# EAGLE design TinyHusk (EAGLE 6.1)

## Sheet 1 of 3
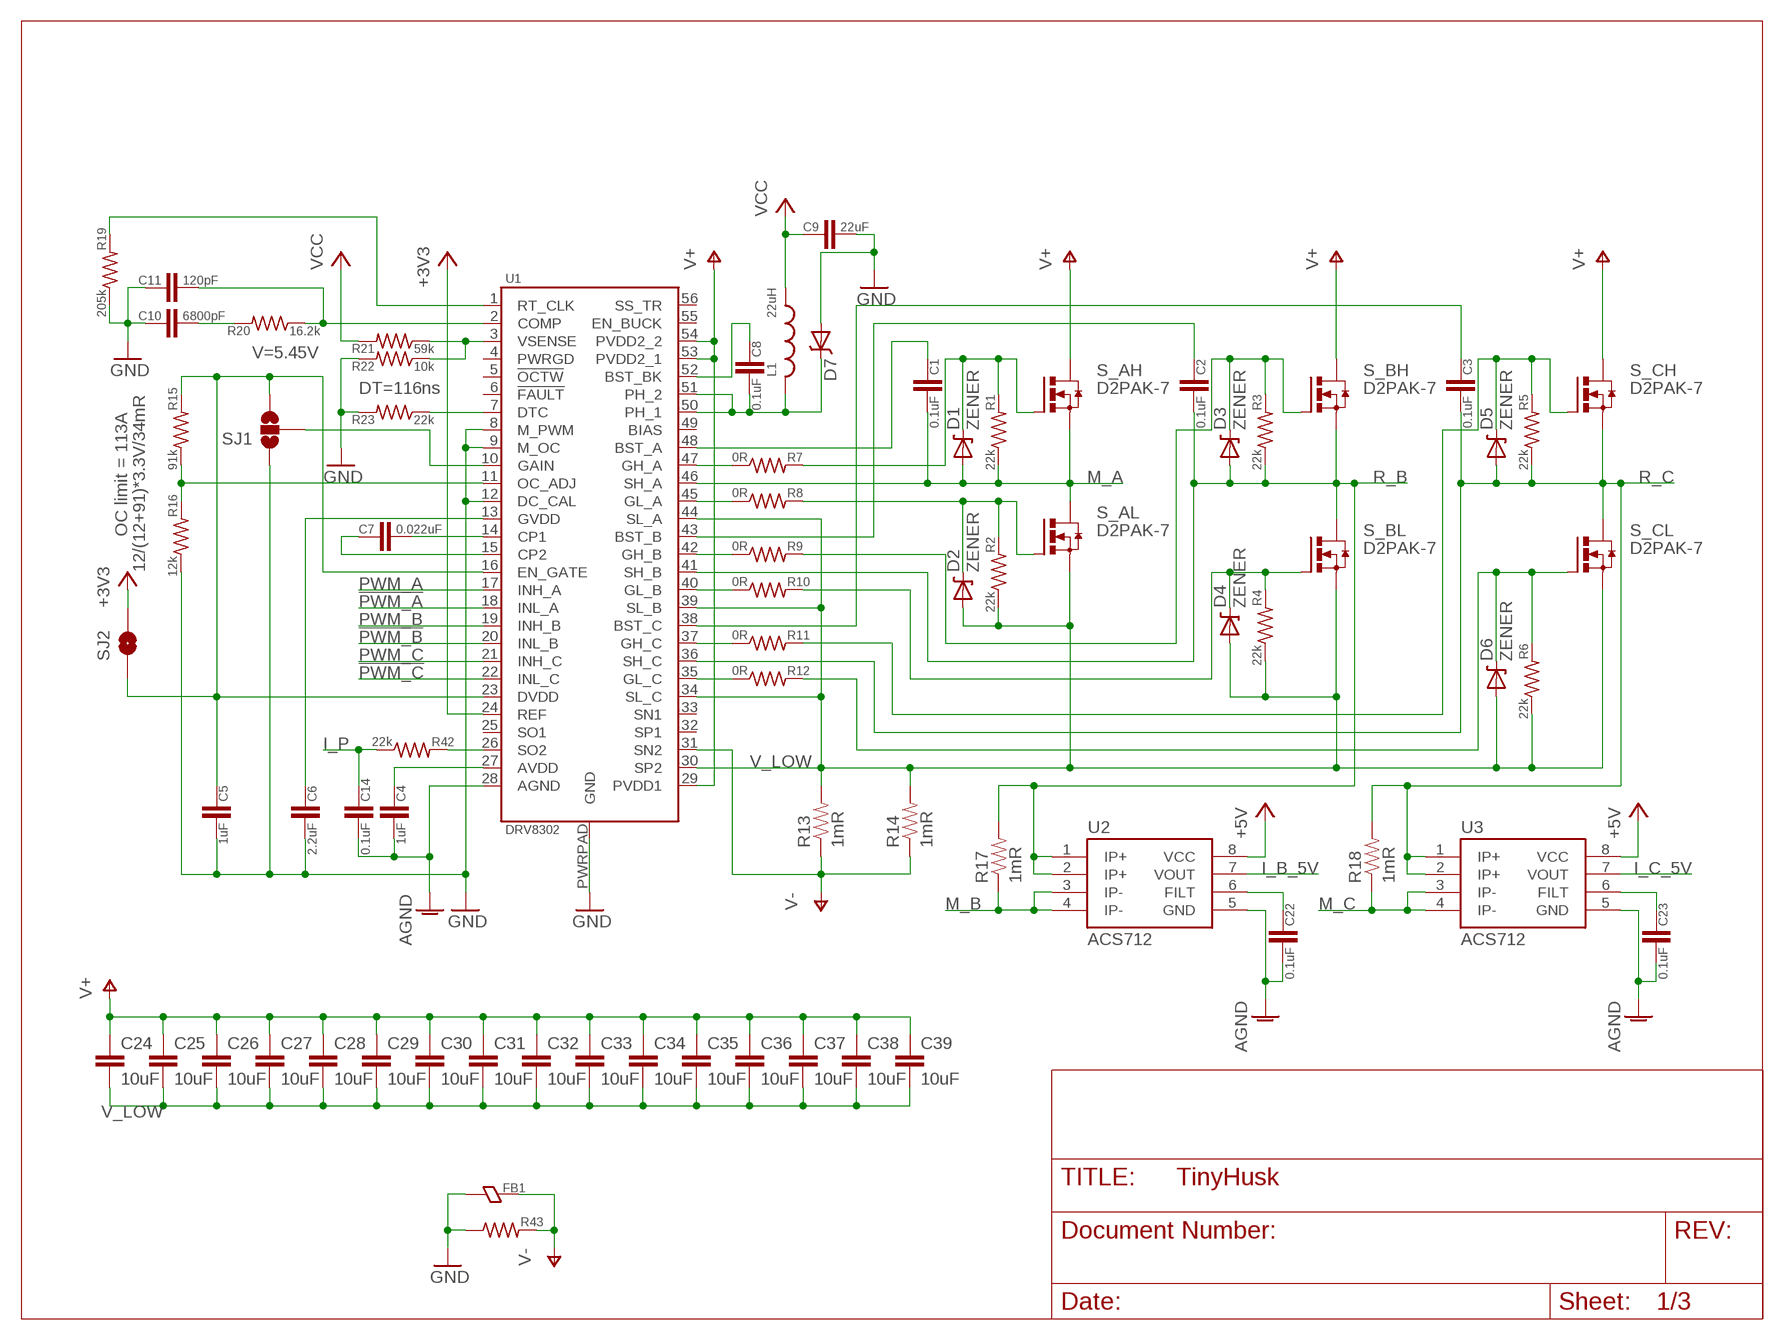
[diagram p0: schematic, sheet 1]

### Parts
C1  0.1uF  C0603  [0603]
C2  0.1uF  C0603  [0603]
C3  0.1uF  C0603  [0603]
C4  1uF  C0603  [0603]
C5  1uF  C0603  [0603]
C6  2.2uF  C0603  [0603]
C7  0.022uF  C0603  [0603]
C8  0.1uF  C0603  [0603]
C9  22uF  C0805  [0805]
C10  6800pF  C0603  [0603]
C11  120pF  C0603  [0603]
C14  0.1uF  C0603  [0603]
C22  0.1uF  C0603  [0603]
C23  0.1uF  C0603  [0603]
C24  10uF  CAP1210  [1210]
C25  10uF  CAP1210  [1210]
C26  10uF  CAP1210  [1210]
C27  10uF  CAP1210  [1210]
C28  10uF  CAP1210  [1210]
C29  10uF  CAP1210  [1210]
C30  10uF  CAP1210  [1210]
C31  10uF  CAP1210  [1210]
C32  10uF  CAP1210  [1210]
C33  10uF  CAP1210  [1210]
C34  10uF  CAP1210  [1210]
C35  10uF  CAP1210  [1210]
C36  10uF  CAP1210  [1210]
C37  10uF  CAP1210  [1210]
C38  10uF  CAP1210  [1210]
C39  10uF  CAP1210  [1210]
D1  ZENER  DIODE-ZENER-BZT52  [SOD-323]
D2  ZENER  DIODE-ZENER-BZT52  [SOD-323]
D3  ZENER  DIODE-ZENER-BZT52  [SOD-323]
D4  ZENER  DIODE-ZENER-BZT52  [SOD-323]
D5  ZENER  DIODE-ZENER-BZT52  [SOD-323]
D6  ZENER  DIODE-ZENER-BZT52  [SOD-323]
D7  DIODE-SCHOTTKY_  [SMA-DIODE]
FB1  FERRITE0603  [0603]
L1  22uH  L-US_TAIYO-YUDEN_NR50  [TAIYO-YUDEN_NR50]
R1  22k  R0603  [0603]
R2  22k  R0603  [0603]
R3  22k  R0603  [0603]
R4  22k  R0603  [0603]
R5  22k  R0603  [0603]
R6  22k  R0603  [0603]
R7  0R  R0603  [0603]
R8  0R  R0603  [0603]
R9  0R  R0603  [0603]
R10  0R  R0603  [0603]
R11  0R  R0603  [0603]
R12  0R  R0603  [0603]
R13  1mR  RESISTOR2512  [R2512]
R14  1mR  RESISTOR2512  [R2512]
R15  91k  R0603  [0603]
R16  12k  R0603  [0603]
R17  1mR  RESISTOR2512  [R2512]
R18  1mR  RESISTOR2512  [R2512]
R19  205k  R0603  [0603]
R20  16.2k  R0603  [0603]
R21  59k  R0603  [0603]
R22  10k  R0603  [0603]
R23  22k  R0603  [0603]
R42  22k  R0603  [0603]
R43  R0603  [0603]
S_AH  D2PAK-7  MOSFET-ND2PAK7  [D2PAK-7]
S_AL  D2PAK-7  MOSFET-ND2PAK7  [D2PAK-7]
S_BH  D2PAK-7  MOSFET-ND2PAK7  [D2PAK-7]
S_BL  D2PAK-7  MOSFET-ND2PAK7  [D2PAK-7]
S_CH  D2PAK-7  MOSFET-ND2PAK7  [D2PAK-7]
S_CL  D2PAK-7  MOSFET-ND2PAK7  [D2PAK-7]
SJ1  SOLDERJUMPER_2WAYS  [SJ_X]
SJ2  SOLDERJUMPERTRACE  [SJ_2S-TRACE]
U1  DRV8302  [HTSSOP-56]
U2  ACS712  [SO08]
U3  ACS712  [SO08]

### Nets
!PWM_A: U1.18(INL_A) ; also sheet 2
!PWM_B: U1.20(INL_B) ; also sheet 2
!PWM_C: U1.22(INL_C) ; also sheet 2
+3V3: SJ2.2 U1.24(REF) ; also sheet 3
+5V: U2.8(VCC) U3.8(VCC) ; also sheet 2,3
AGND: C4.2 C14.2 C22.2 C23.2 U1.28(AGND) U2.5(GND) U3.5(GND) ; also sheet 2,3
GND: C5.2 C6.2 C9.2 C10.1 C11.1 D7.A FB1.1 R16.1 R19.1 R22.2 R23.2 R43.1 SJ1.1 U1.8(M_PWM) U1.9(M_OC) U1.12(DC_CAL) U1.PWRPAD(GND) ; also sheet 2,3
I_B_5V: U2.7(VOUT) ; also sheet 2
I_C_5V: U3.7(VOUT) ; also sheet 2
I_P: C14.1 R42.1 ; also sheet 2
M_A: C1.2 D1.2(A) R1.1 S_AH.2(S) S_AH.3(S) S_AH.5(S) S_AH.6(S) S_AH.7(S) S_AL.4(D) U1.46(SH_A) ; also sheet 2
M_B: R17.1 U2.3(IP-) U2.4(IP-)
M_C: R18.1 U3.3(IP-) U3.4(IP-)
N$1: R7.1 U1.47(GH_A)
N$2: R8.1 U1.45(GL_A)
N$3: R42.2 U1.26(SO2)
N$4: D1.1(C) R1.2 R7.2 S_AH.1(G)
N$5: D3.1(C) R3.2 R9.2 S_BH.1(G)
N$6: C22.1 U2.6(FILT)
N$7: D4.1(C) R4.2 R10.2 S_BL.1(G)
N$8: R21.1 R22.1 U1.3(VSENSE)
N$9: D5.1(C) R5.2 R11.2 S_CH.1(G)
N$10: C23.1 U3.6(FILT)
N$11: D6.1(C) R6.2 R12.2 S_CL.1(G)
N$12: R9.1 U1.42(GH_B)
N$13: C1.1 U1.48(BST_A)
N$14: C2.1 U1.43(BST_B)
N$15: C3.1 U1.38(BST_C)
N$16: R10.1 U1.40(GL_B)
N$17: R11.1 U1.37(GH_C)
N$18: D2.1(C) R2.2 R8.2 S_AL.1(G)
N$19: R12.1 U1.35(GL_C)
N$20: SJ1.2 U1.10(GAIN)
N$21: C5.1 R15.2 SJ1.3 SJ2.1 U1.16(EN_GATE) U1.23(DVDD)
N$22: C4.1 U1.27(AVDD)
N$23: C6.1 U1.13(GVDD)
N$24: C7.2 U1.14(CP1)
N$25: C7.1 U1.15(CP2)
N$26: R15.1 R16.2 U1.11(OC_ADJ)
N$29: C8.2 D7.C L1.P$2 U1.50(PH_1) U1.51(PH_2)
N$30: C8.1 U1.52(BST_BK)
N$31: C11.2 R20.1 U1.2(COMP)
N$32: C10.2 R20.2
N$33: R19.2 U1.1(RT_CLK)
N$34: R23.1 U1.7(DTC)
PWM_A: U1.17(INH_A) ; also sheet 2
PWM_B: U1.19(INH_B) ; also sheet 2
PWM_C: U1.21(INH_C) ; also sheet 2
R_B: C2.2 D3.2(A) R3.1 R17.2 S_BH.2(S) S_BH.3(S) S_BH.5(S) S_BH.6(S) S_BH.7(S) S_BL.4(D) U1.41(SH_B) U2.1(IP+) U2.2(IP+) ; also sheet 2
R_C: C3.2 D5.2(A) R5.1 R18.2 S_CH.2(S) S_CH.3(S) S_CH.5(S) S_CH.6(S) S_CH.7(S) S_CL.4(D) U1.36(SH_C) U3.1(IP+) U3.2(IP+) ; also sheet 2
V+: C24.1 C25.1 C26.1 C27.1 C28.1 C29.1 C30.1 C31.1 C32.1 C33.1 C34.1 C35.1 C36.1 C37.1 C38.1 C39.1 S_AH.4(D) S_BH.4(D) S_CH.4(D) U1.29(PVDD1) U1.53(PVDD2_1) U1.54(PVDD2_2) ; also sheet 2
V-: FB1.2 R13.1 R14.1 R43.2 U1.31(SN2) ; also sheet 2
V_LOW: C24.2 C25.2 C26.2 C27.2 C28.2 C29.2 C30.2 C31.2 C32.2 C33.2 C34.2 C35.2 C36.2 C37.2 C38.2 C39.2 D2.2(A) D4.2(A) D6.2(A) R2.1 R4.1 R6.1 R13.2 R14.2 S_AL.2(S) S_AL.3(S) S_AL.5(S) S_AL.6(S) S_AL.7(S) S_BL.2(S) S_BL.3(S) S_BL.5(S) S_BL.6(S) S_BL.7(S) S_CL.2(S) S_CL.3(S) S_CL.5(S) S_CL.6(S) S_CL.7(S) U1.30(SP2) U1.34(SL_C) U1.39(SL_B) U1.44(SL_A)
VCC: C9.1 L1.P$1 R21.2 ; also sheet 3
Unconnected: U1.4(PWRGD) U1.5(!OCTW) U1.6(!FAULT) U1.25(SO1) U1.32(SP1) U1.33(SN1) U1.49(BIAS) U1.55(EN_BUCK) U1.56(SS_TR)

### Notes on the sheet
- V=5.45V
- DT=116ns
- OC limit = 113A
- 12/(12+91)*3.3V/34mR

## Sheet 2 of 3
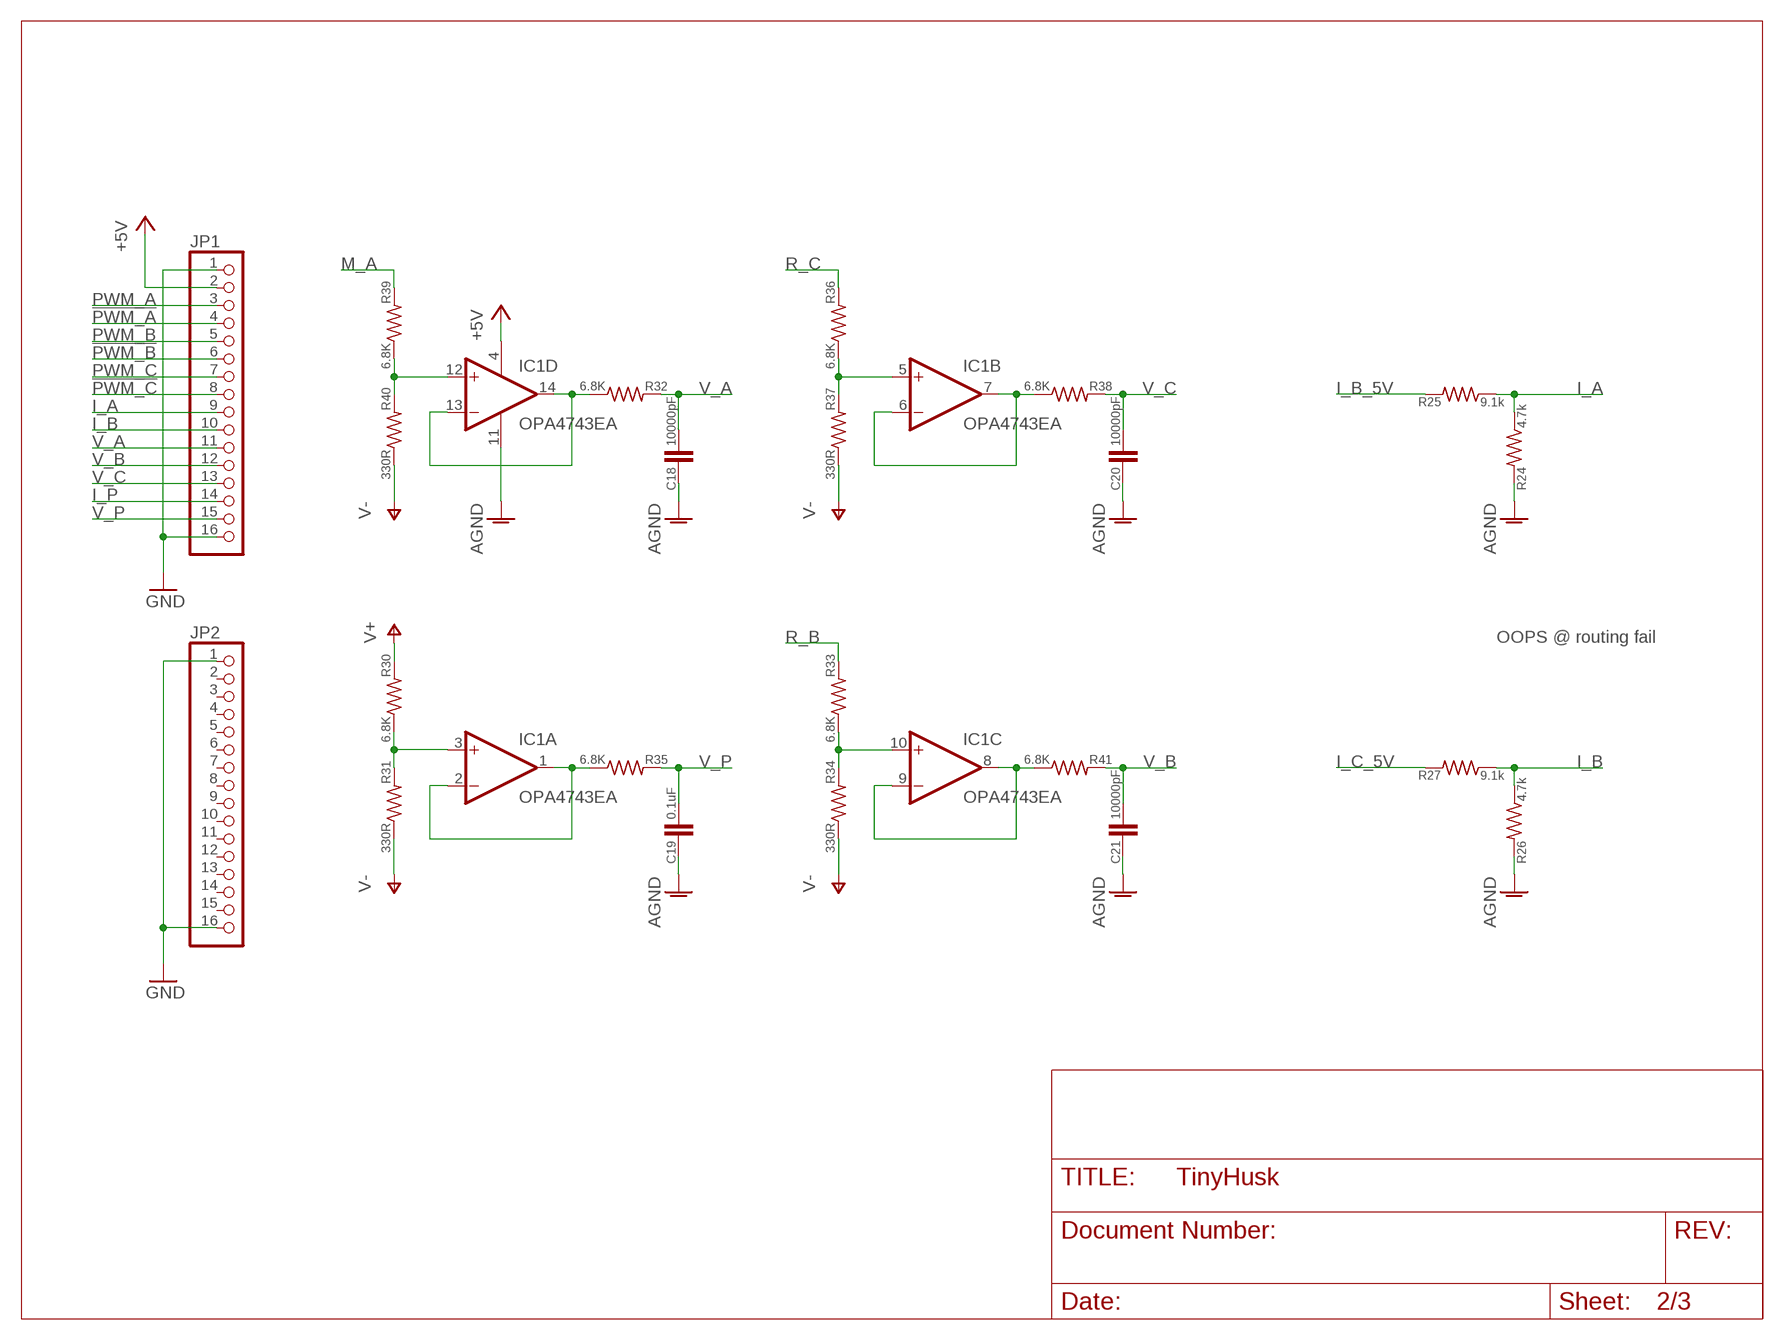
[diagram p1: schematic, sheet 2]

### Parts
C18  10000pF  C0603  [0603]
C19  0.1uF  C0603  [0603]
C20  10000pF  C0603  [0603]
C21  10000pF  C0603  [0603]
IC1  OPA4743EA  [TSSOP14]
JP1  PINHD-1X16_2.54-S  [1X16-S]
JP2  PINHD-1X16_2.54-S  [1X16-S]
R24  4.7k  R0603  [0603]
R25  9.1k  R0603  [0603]
R26  4.7k  R0603  [0603]
R27  9.1k  R0603  [0603]
R30  6.8K  R0603  [0603]
R31  330R  R0603  [0603]
R32  6.8K  R0603  [0603]
R33  6.8K  R0603  [0603]
R34  330R  R0603  [0603]
R35  6.8K  R0603  [0603]
R36  6.8K  R0603  [0603]
R37  330R  R0603  [0603]
R38  6.8K  R0603  [0603]
R39  6.8K  R0603  [0603]
R40  330R  R0603  [0603]
R41  6.8K  R0603  [0603]

### Nets
!PWM_A: JP1.4 ; also sheet 1
!PWM_B: JP1.6 ; also sheet 1
!PWM_C: JP1.8 ; also sheet 1
+5V: IC1.4(P:V+) JP1.2 ; also sheet 1,3
AGND: C18.1 C19.1 C20.1 C21.1 IC1.11(P:V-) R24.2 R26.2 ; also sheet 1,3
GND: JP1.1 JP1.16 JP2.1 JP2.16 ; also sheet 1,3
I_A: JP1.9 R24.1 R25.1
I_B: JP1.10 R26.1 R27.1
I_B_5V: R25.2 ; also sheet 1
I_C_5V: R27.2 ; also sheet 1
I_P: JP1.14 ; also sheet 1
M_A: R39.2 ; also sheet 1
N$36: IC1.1(A:OUT) IC1.2(A:-IN) R35.1
N$41: IC1.6(B:-IN) IC1.7(B:OUT) R38.1
N$42: IC1.8(C:OUT) IC1.9(C:-IN) R41.1
N$43: IC1.13(D:-IN) IC1.14(D:OUT) R32.1
N$44: IC1.3(A:+IN) R30.1 R31.2
N$46: IC1.10(C:+IN) R33.1 R34.2
N$47: IC1.5(B:+IN) R36.1 R37.2
N$48: IC1.12(D:+IN) R39.1 R40.2
PWM_A: JP1.3 ; also sheet 1
PWM_B: JP1.5 ; also sheet 1
PWM_C: JP1.7 ; also sheet 1
R_B: R33.2 ; also sheet 1
R_C: R36.2 ; also sheet 1
V+: R30.2 ; also sheet 1
V-: R31.1 R34.1 R37.1 R40.1 ; also sheet 1
V_A: C18.2 JP1.11 R32.2
V_B: C21.2 JP1.12 R41.2
V_C: C20.2 JP1.13 R38.2
V_P: C19.2 JP1.15 R35.2
Unconnected: JP2.2 JP2.3 JP2.4 JP2.5 JP2.6 JP2.7 JP2.8 JP2.9 JP2.10 JP2.11 JP2.12 JP2.13 JP2.14 JP2.15

### Notes on the sheet
- OOPS @ routing fail

## Sheet 3 of 3
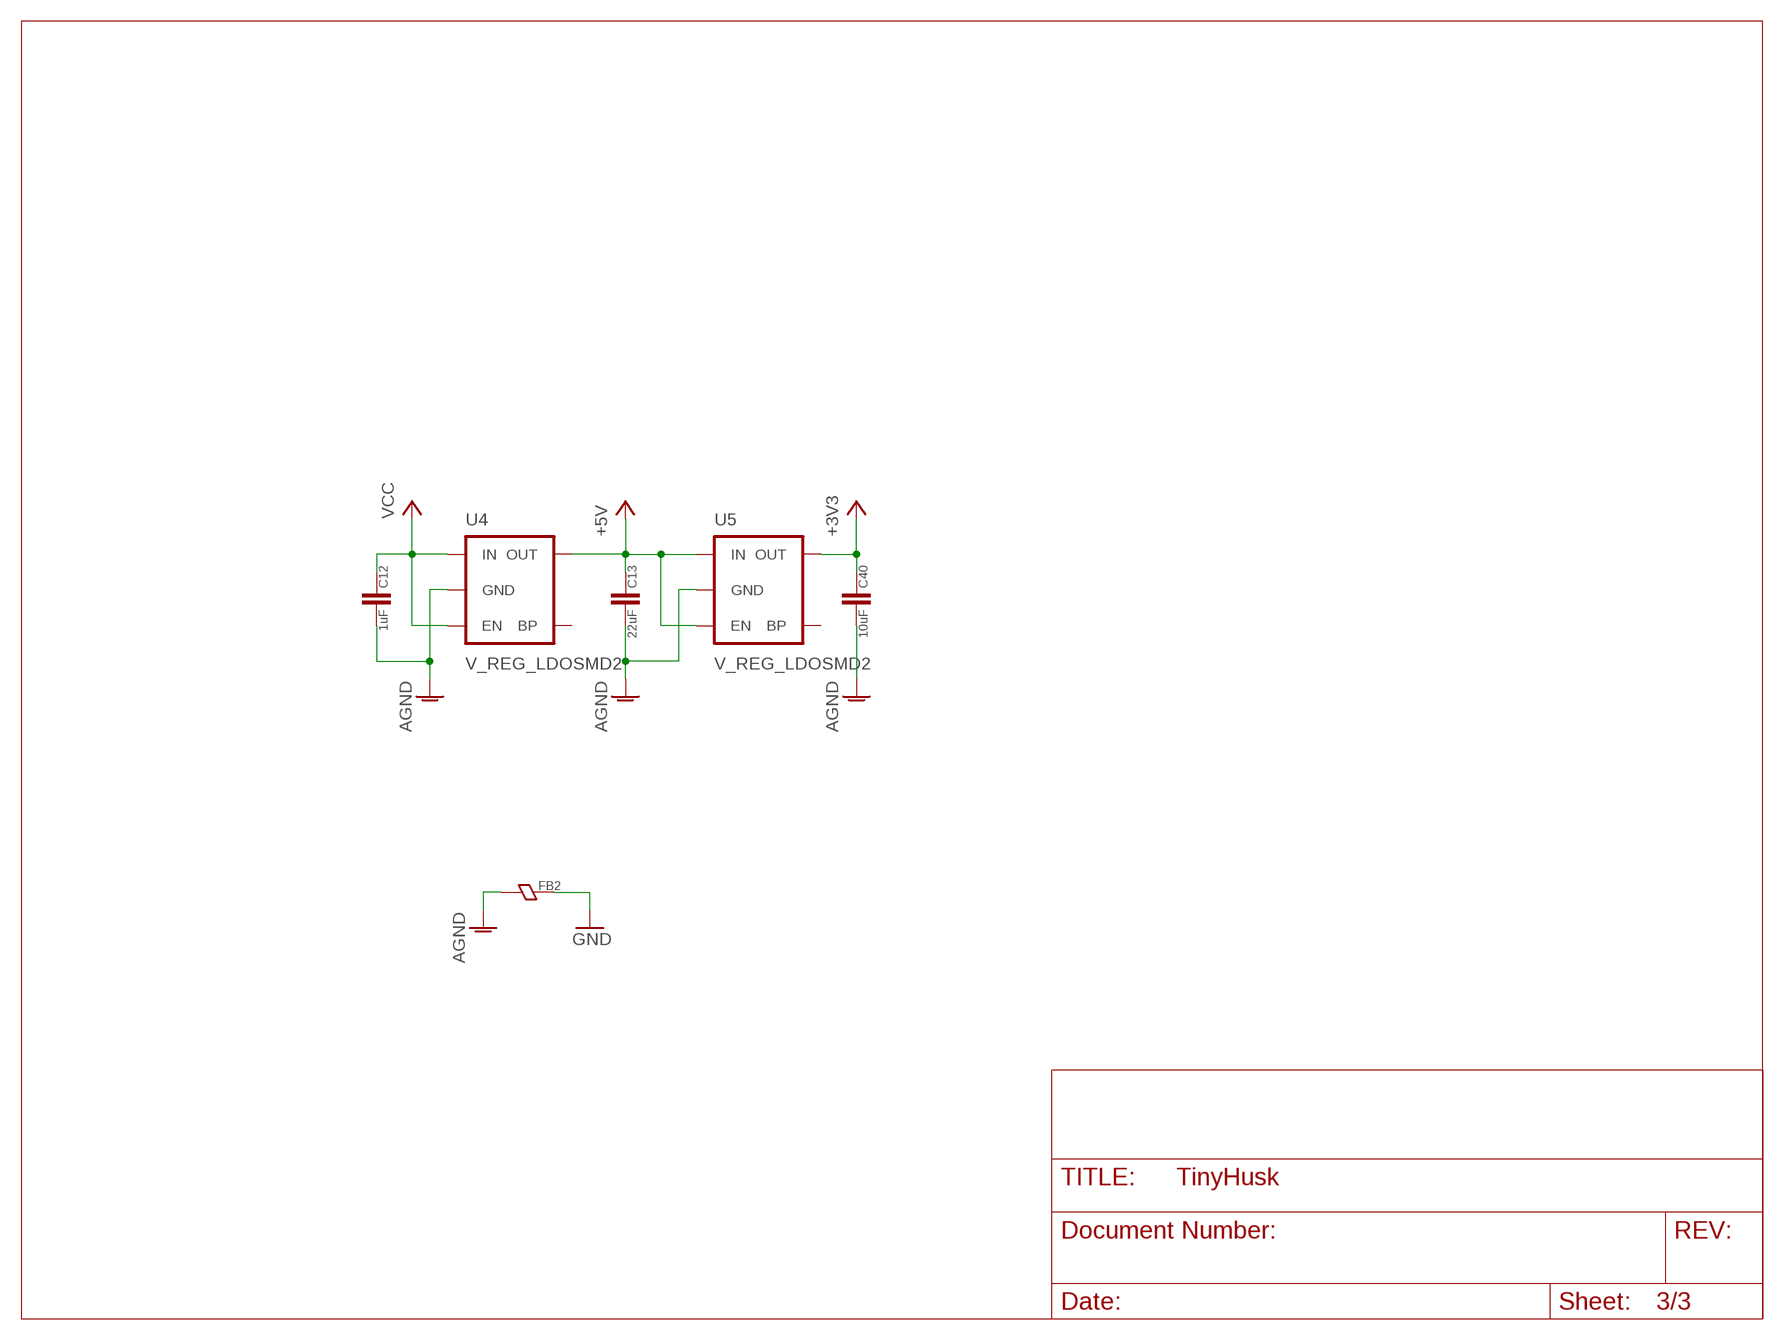
[diagram p2: schematic, sheet 3]

### Parts
C12  1uF  C0603  [0603]
C13  22uF  C0805  [0805]
C40  10uF  C0603  [0603]
FB2  FERRITE0603  [0603]
U4  V_REG_LDOSMD2  [SC70]
U5  V_REG_LDOSMD2  [SC70]

### Nets
+3V3: C40.1 U5.5(OUT) ; also sheet 1
+5V: C13.1 U4.5(OUT) U5.1(IN) U5.3(EN) ; also sheet 1,2
AGND: C12.2 C13.2 C40.2 FB2.1 U4.2(GND) U5.2(GND) ; also sheet 1,2
GND: FB2.2 ; also sheet 1,2
VCC: C12.1 U4.1(IN) U4.3(EN) ; also sheet 1
Unconnected: U4.4(BP) U5.4(BP)

## Library data of the parts
C1-C14 C18-C23 C40 = dan-rcl:C
C24-C39 = SparkFun:CAP: Capacitor Standard 0603 ceramic capacitor, and 0.1" leaded capacitor.
D1-D6 = SparkFun:DIODE-ZENER: Zener Diode Production Part - 8199 3.4V Zener Voltage
D7 = SparkFun:DIODE-SCHOTTKY
FB1 FB2 = dan-rcl:FERRITE: Ferrite Bead
IC1 = linear:OPA4743: 12V, 7MHz, CMOS, Rail-to-Rail I/O Quad OP AMP Source: http://focus.ti.com/lit/ds/sbos201/sbos201.pdf
JP1 JP2 = pinhead-2:PINHD-1X16: PIN HEADER
L1 = xow:L-US_TAIYO-YUDEN_NR
R1-R12 R15 R16 R19-R27 R30-R43 = dan-rcl:R
R13 R14 R17 R18 = SparkFun:RESISTOR: Resistor Basic schematic elements and footprints for 0603, 1206, and PTH resistors.
S_AH S_AL S_BH S_BL S_CH S_CL = xow:MOSFET-N: Power NMOSFETs in: - D2PAK-7 - 5mm x 6mm (Power56/PQFN 5x6)
SJ1 = xow:SOLDERJUMPER_2WAY: Solder Jumper 2 way solder jumper
SJ2 = SparkFun:SOLDERJUMPER: Solder Jumper Standard SMD solder jumper. Used to automate production. Two varients : Normally Open and Normally Closed are the same, but have different paste layers. NC will have a large amount of paste and should jumper during reflow.
U1 = xow:DRV8302
U2 U3 = SparkFun:ACS712
U4 U5 = SparkFun:V_REG_LDO: Voltage Regulator LDO Standard 150mA LDO voltage regulator in SOT-23 layout. Micrel part MIC5205. BP (by-pass) pin is used to lower output noise with 470pF cap.

## Board
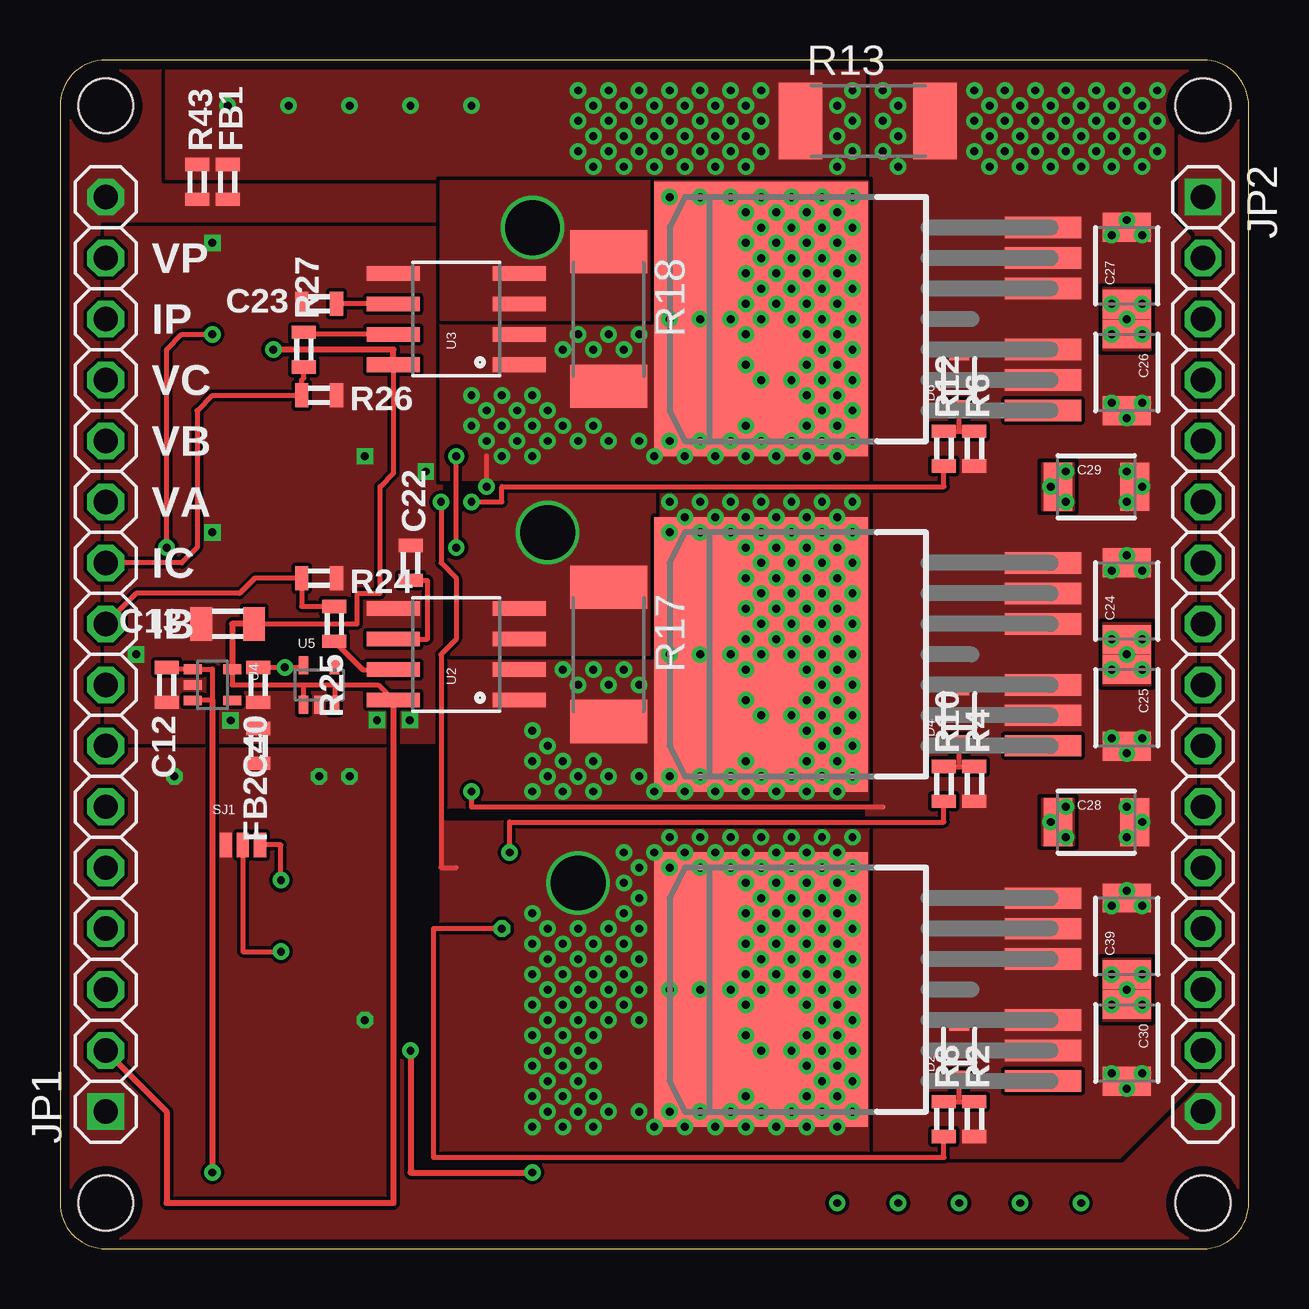
[diagram p3: board, top side]
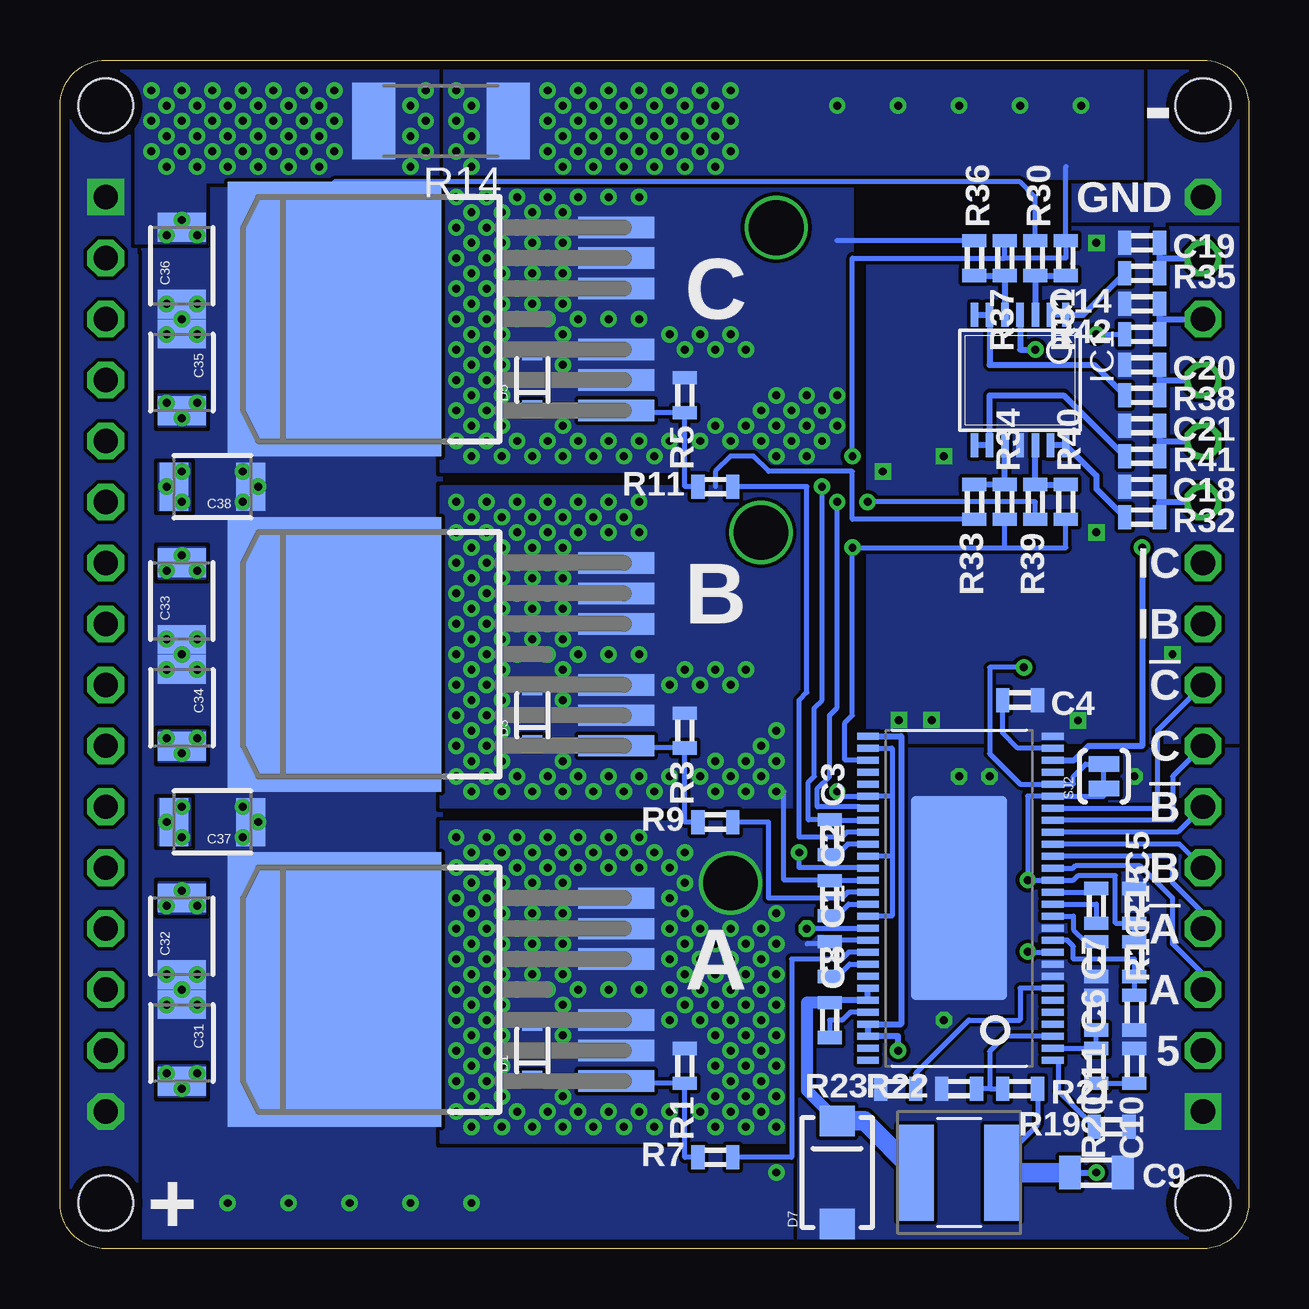
[diagram p4: board, bottom side, seen from below]

Size 49.53 x 49.53 mm. Coordinates in mm from the lower left corner, seen from the top.
Outline: 0,47.62 0,1.91 arc90 1.91,0 47.62,0 arc90 49.53,1.91 49.53,47.62 arc90 47.62,49.53 1.91,49.53 arc90 0,47.62
Copper layers (1*16): Top 0.0356mm / dielectric 1.5011mm / Bottom 0.0356mm
Design rules: minimum track width 6mil, minimum drill 13mil, track to track 6mil, track to pad 6mil, pad to pad 6mil, via to via 6mil, smd to smd 6mil, copper to edge 15mil, drill to drill 6mil, minimum pad ring 7mil, minimum via ring 7mil, stop-mask expansion 4mil, vias tented up to drill 13mil, thermal gap 10mil
Holes 2.29 mm at 1.91,47.62 47.62,47.62 47.62,1.91 1.91,1.91

### Footprints (pad centres in the part's own frame; a part is rotated, then mirrored left to right if it is on the bottom)
0603 = smd 0.55 x 1: 1 -0.725,0; 2 0.725,0
0805 = smd 0.9 x 1.4: 1 -1.1,0; 2 1.1,0
1210 = smd 1.2 x 2: 1 -1.6,0; 2 1.6,0
SOD-323 = smd 0.63 x 0.83: 1 -1.15,0; 2 1.15,0
SMA-DIODE = smd 1.27 x 1.47: A -2.15,0; C 2.15,0
TSSOP14 = smd 0.305 x 0.991: 1 -1.905,-2.718; 2 -1.27,-2.718; 3 -0.635,-2.718; 4 0,-2.718; 5 0.635,-2.718; 6 1.27,-2.718; 7 1.905,-2.718; 8 1.905,2.718; 9 1.27,2.718; 10 0.635,2.718; 11 0,2.718; 12 -0.635,2.718; 13 -1.27,2.718; 14 -1.905,2.718
1X16-S = drill 1.016 square: 1 -19.05,0 | drill 1.016 octagon: 2 -16.51,0; 3 -13.97,0; 4 -11.43,0; 5 -8.89,0; 6 -6.35,0; 7 -3.81,0; 8 -1.27,0; 9 1.27,0; 10 3.81,0; 11 6.35,0; 12 8.89,0; 13 11.43,0; 14 13.97,0; 15 16.51,0; 16 19.05,0
TAIYO-YUDEN_NR50 = smd 1.5 x 4: P$1 -1.8,0; P$2 1.8,0
R2512 = smd 1.8 x 3.2: 1 -2.8,0; 2 2.8,0
D2PAK-7 = smd 0.889 x 3.175: 1 -3.81,-7.303; 2 -2.54,-7.303; 3 -1.27,-7.303; 5 1.27,-7.303; 6 2.54,-7.303; 7 3.81,-7.303 | smd 11.43 x 8.89: 4 0,4.445
SJ_X = smd 0.508 x 1.016: 1 -0.711,0; 2 0,0; 3 0.711,0
SJ_2S-TRACE = smd 0.635 x 1.27: 1 -0.508,0; 2 0.508,0
HTSSOP-56 = smd 0.285 x 0.9: 1 -6.75,-3.9; 2 -6.25,-3.9; 3 -5.75,-3.9; 4 -5.25,-3.9; 5 -4.75,-3.9; 6 -4.25,-3.9; 7 -3.75,-3.9; 8 -3.25,-3.9; 9 -2.75,-3.9; 10 -2.25,-3.9; 11 -1.75,-3.9; 12 -1.25,-3.9; 13 -0.75,-3.9; 14 -0.25,-3.9; 15 0.25,-3.9; 16 0.75,-3.9; 17 1.25,-3.9; 18 1.75,-3.9; 19 2.25,-3.9; 20 2.75,-3.9; 21 3.25,-3.9; 22 3.75,-3.9; 23 4.25,-3.9; 24 4.75,-3.9; 25 5.25,-3.9; 26 5.75,-3.9; 27 6.25,-3.9; 28 6.75,-3.9; 29 6.75,3.8; 30 6.25,3.8; 31 5.75,3.8; 32 5.25,3.8; 33 4.75,3.8; 34 4.25,3.8; 35 3.75,3.8; 36 3.25,3.8; 37 2.75,3.8; 38 2.25,3.8; 39 1.75,3.8; 40 1.25,3.8; 41 0.75,3.8; 42 0.25,3.8; 43 -0.25,3.8; 44 -0.75,3.8; 45 -1.25,3.8; 46 -1.75,3.8; 47 -2.25,3.8; 48 -2.75,3.8; 49 -3.25,3.8; 50 -3.75,3.8; 51 -4.25,3.8; 52 -4.75,3.8; 53 -5.25,3.8; 54 -5.75,3.8; 55 -6.25,3.8; 56 -6.75,3.8 | smd 8.5 x 4: PWRPAD 0,0
SO08 = smd 0.61 x 2.21: 1 -1.905,-2.616; 2 -0.635,-2.616; 3 0.635,-2.616; 4 1.905,-2.616; 5 1.905,2.616; 6 0.635,2.616; 7 -0.635,2.616; 8 -1.905,2.616
SC70 = smd 0.4 x 0.75: 1 -0.65,-0.825; 2 0,-0.825; 3 0.65,-0.825; 4 0.65,0.825; 5 -0.65,0.825

### Placement (x,y rotation side)
C1  17.46,12.06 90 bottom
C2  17.46,14.61 90 bottom
C3  17.46,17.15 90 bottom
C4  9.53,22.86 0 bottom
C5  4.76,14.29 90 bottom
C6  6.35,12.06 270 bottom
C7  6.35,14.29 270 bottom
C8  17.46,9.53 90 bottom
C9  6.35,3.17 0 bottom
C10  4.76,7.62 270 bottom
C11  6.35,9.84 270 bottom
C12  4.45,23.5 270 top
C13  6.98,26.04 180 top
C14  4.45,39.37 180 bottom
C18  4.45,31.75 0 bottom
C19  4.45,41.91 0 bottom
C20  4.45,36.83 0 bottom
C21  4.45,34.29 0 bottom
C22  14.61,28.58 90 top
C23  10.79,39.37 180 top
C24  44.45,26.99 90 top
C25  44.45,22.54 270 top
C26  44.45,36.51 270 top
C27  44.45,40.96 90 top
C28  43.18,17.78 0 top
C29  43.18,31.75 0 top
C30  44.45,8.57 270 top
C31  44.45,8.57 270 bottom
C32  44.45,13.02 90 bottom
C33  44.45,26.99 90 bottom
C34  44.45,22.54 270 bottom
C35  44.45,36.51 270 bottom
C36  44.45,40.96 90 bottom
C37  43.18,17.78 180 bottom
C38  43.18,31.75 180 bottom
C39  44.45,13.02 90 top
C40  8.26,23.5 270 top
D1  29.85,8.26 90 bottom
D2  37.46,8.26 90 top
D3  29.85,22.23 90 bottom
D4  37.46,22.23 90 top
D5  29.85,36.2 90 bottom
D6  37.46,36.2 90 top
D7  17.15,3.17 90 bottom
FB1  6.98,44.45 90 top
FB2  8.26,20.96 270 top
IC1  9.53,36.2 180 bottom
JP1  1.91,24.77 90 top
JP2  47.62,24.77 270 top
L1  12.06,3.17 180 bottom
R1  23.5,7.62 270 bottom
R2  38.1,5.4 90 top
R3  23.5,21.59 270 bottom
R4  38.1,19.37 90 top
R5  23.5,35.56 270 bottom
R6  38.1,33.34 90 top
R7  22.23,3.81 180 bottom
R8  36.83,5.4 90 top
R9  22.23,17.78 180 bottom
R10  36.83,19.37 90 top
R11  22.23,31.75 180 bottom
R12  36.83,33.34 90 top
R13  33.66,46.99 0 top
R14  33.66,46.99 180 bottom
R15  4.76,12.06 90 bottom
R16  4.76,9.84 90 bottom
R17  22.86,24.77 270 top
R18  22.86,38.73 270 top
R19  5.71,5.08 180 bottom
R20  6.35,7.62 270 bottom
R21  9.53,6.67 0 bottom
R22  12.06,6.67 180 bottom
R23  14.61,6.67 180 bottom
R24  10.79,27.94 0 top
R25  11.43,26.04 270 top
R26  10.79,35.56 0 top
R27  10.16,37.46 90 top
R30  8.89,41.27 90 bottom
R31  7.62,41.27 270 bottom
R32  4.45,30.48 0 bottom
R33  11.43,31.12 270 bottom
R34  10.16,31.12 90 bottom
R35  4.45,40.64 0 bottom
R36  11.43,41.27 90 bottom
R37  10.16,41.27 270 bottom
R38  4.45,35.56 0 bottom
R39  8.89,31.12 270 bottom
R40  7.62,31.12 90 bottom
R41  4.45,33.02 0 bottom
R42  4.45,38.1 180 bottom
R43  5.71,44.45 90 top
S_AH  33.66,10.79 90 bottom
S_AL  33.66,10.79 90 top
S_BH  33.66,24.77 90 bottom
S_BL  33.66,24.77 90 top
S_CH  33.66,38.73 90 bottom
S_CL  33.66,38.73 90 top
SJ1  7.62,16.83 0 top
SJ2  6.03,19.69 90 bottom
U1  12.06,14.61 90 bottom
U2  16.51,24.77 90 top
U3  16.51,38.73 90 top
U4  6.35,23.5 270 top
U5  10.79,23.5 0 top

### Tracks (layer width: path | path; a pad name or v marks a point on that pad's centre or on a via)
!PWM_A
  Bottom 0.203: JP1.4 1.91,13.97 3.17,15.24 3.17,16.36 U1.18 7.3,16.36
!PWM_B
  Bottom 0.203: JP1.6 2.96,17.36 U1.20
!PWM_C
  Bottom 0.203: JP1.8 3.81,21.59 3.81,18.36 U1.22
+3V3  (via drill 0.33)
  Top 0.203: C40.1 v9.37,24.22 10.14,24.22 U5.5
  Bottom 0.203: v9.37,24.22 10.79,24.22 10.79,20.62 9.53,19.36 U1.24 7.3,19.36 7.3,19.69 6.79,20.19 SJ2.2
+5V  (via drill 0.33)
  Top 0.203: U4.5 7.17,23.5 10.14,23.5 | U2.8 13.26,23.5 11.45,23.5 | C13.1 12.38,26.04 12.38,27.31 13.33,27.31 13.33,31.75 13.89,32.31 U3.8 | 10.14,23.5 U5.1 | 10.14,23.5 11.45,23.5 | 11.45,23.5 U5.3
  Top 0.254: JP1.2 4.45,5.71 4.45,1.91 13.89,1.91 U2.8 | U3.8 13.89,37.46 v8.89,37.46 | C13.1 7.17,26.04 U4.5
  Bottom 0.254: IC1.4 9.53,37.46 v8.89,37.46
AGND  (via drill 0.33)
  other vias: 3.17,24.77 15.24,32.38 12.7,33.02 6.35,29.85 6.35,41.91 7.11,22.01 14.58,22.02 13.21,22.02
  pour Bottom (rank 5, no thermals): 0,42.54 15.88,42.54 15.88,21.11 0,21.11
  pour Top (rank 5, no thermals): 1.91,42.54 1.91,21.11 15.88,21.11 15.88,42.54
GND  (via drill 0.33)
  other vias: 12.7,9.53 12.06,19.69 10.79,19.69 4.76,19.69
  pour Bottom (rank 6, no thermals): 47.62,0 1.91,0 arc-90 0,1.91 0,47.62 arc-90 1.91,49.53 47.62,49.53 arc-90 49.53,47.62 49.53,1.91 arc-90
  pour Top (rank 6, no thermals): 47.62,0 1.91,0 arc-90 0,1.91 0,47.62 arc-90 1.91,49.53 47.62,49.53 arc-90 49.53,47.62 49.53,1.91 arc-90
I_A
  Top 0.203: JP1.9 3.17,27.31 7.49,27.31 8.12,27.94 R24.1 10.07,26.76 R25.1
I_B
  Top 0.203: JP1.10 5.08,28.58 5.71,29.21 5.71,34.92 6.35,35.56 R26.1 10.07,36.2 10.16,36.28 R27.1
I_B_5V
  Top 0.203: R25.2 12.61,24.13 U2.7
I_C_5V
  Top 0.203: U3.7 10.16,38.1 R27.2
I_P
  Bottom 0.254: C14.1 3.72,38.73 | 3.72,38.73 JP1.14 | 3.72,38.73 R42.1
M_A  (via drill 0.33, 2.29)
  Top 0.203: v15.88,31.12 15.88,28.58 16.51,27.94 16.51,25.4 15.88,24.77 15.88,15.88 16.51,15.88
  Bottom 0.203: U1.46 17.08,12.86 C1.2 17.15,12.7 18.42,12.7 | R39.2 8.89,31.12 v15.88,31.12
  other vias: 33.02,17.15 32.38,16.51 33.02,15.88 32.38,15.24 33.02,14.61 32.38,13.97 33.02,13.33 32.38,12.7 33.02,12.06 32.38,11.43 33.02,10.79 32.38,10.16 33.02,9.53 32.38,8.89 33.02,8.26 32.38,7.62 33.02,6.98 32.38,6.35 33.02,5.71 31.75,17.15 31.12,16.51 31.75,15.88 31.12,15.24 31.75,14.61 31.12,13.97 31.75,13.33 31.12,12.7 31.75,12.06 31.12,11.43 31.75,10.79 31.12,10.16 31.75,9.53 31.12,8.89 31.75,8.26 31.12,7.62 31.75,6.98 31.12,6.35 31.75,5.71 21.59,13.33 20.96,12.7 21.59,12.06 20.96,11.43 21.59,10.79 20.96,10.16 21.59,9.53 20.96,8.89 21.59,8.26 20.96,7.62 21.59,6.98 20.96,6.35 21.59,5.71 19.69,13.97 20.32,13.33 19.69,12.7 20.32,12.06 19.69,11.43 20.32,10.79 19.69,10.16 20.32,9.53 19.69,8.89 20.32,8.26 19.69,7.62 20.32,6.98 19.69,6.35 20.32,5.71 22.86,13.33 22.23,12.7 22.86,12.06 22.23,11.43 22.86,10.79 22.23,10.16 22.86,9.53 22.23,8.89 22.23,7.62 22.23,6.35 22.86,5.71 23.5,16.51 24.13,15.88 23.5,15.24 24.13,14.61 23.5,13.97 24.13,13.33 23.5,12.7 24.13,12.06 23.5,11.43 24.13,10.79 23.5,10.16 24.13,9.53 30.48,17.15 29.85,16.51 30.48,15.88 29.85,15.24 30.48,14.61 29.85,13.97 30.48,13.33 29.85,12.7 30.48,12.06 29.85,11.43 30.48,10.79 29.21,17.15 28.58,16.51 29.21,15.88 28.58,15.24 29.21,14.61 28.58,13.97 29.21,13.33 28.58,12.7 29.21,12.06 28.58,11.43 29.21,10.79 28.58,10.16 28.58,8.89 30.48,8.26 29.21,8.26 30.48,5.71 29.21,5.71 28.58,6.35 27.94,5.71 26.67,5.71 25.4,5.71 24.13,5.71 27.94,10.79 26.67,10.79 25.4,10.79 27.94,17.15 27.31,16.51 26.67,17.15 26.04,16.51 25.4,17.15 24.77,16.51 25.4,15.88 26.67,15.88 27.94,15.88 19.69,5.08 20.96,5.08 22.23,5.08 24.77,5.08 26.04,5.08 27.31,5.08 28.58,5.08 29.85,5.08 31.12,5.08 32.38,5.08 21.59,15.24
  pour Bottom (rank 2, no thermals): 33.66,17.78 20,17.78 20,14.61 17.78,14.61 17.78,12.06 19.05,12.06 19.05,4.45 33.66,4.45
  pour Top (rank 2, no thermals): 15.88,17.78 33.66,17.78 33.66,3.81 15.88,3.81
M_B  (via drill 2.29)
  other vias: 20.32,29.85
  pour Top (no thermals): 24.77,31.75 15.88,31.75 15.88,24.77 24.77,24.77
M_C  (via drill 2.29)
  other vias: 19.69,42.54
  pour Top (no thermals): 24.77,38.73 15.88,38.73 15.88,44.45 24.77,44.45
N$1
  Bottom 0.203: U1.47 16.66,12.36 16.96,12.06 19.05,12.06 19.05,3.81 R7.1
N$2  (via drill 0.33)
  Top 0.203: v18.42,13.33 15.56,13.33 15.56,3.81 36.83,3.81 R8.1
  Bottom 0.203: U1.45 16.19,13.33 v18.42,13.33
N$3  (via drill 0.33)
  Top 0.203: v4.45,29.21 4.45,37.46 5.08,38.1 v6.35,38.1
  Bottom 0.203: v6.35,38.1 R42.2
  Bottom 0.254: U1.26 7.27,20.36 6.67,20.96 4.45,20.96 v4.45,29.21
N$4
  Bottom 0.203: R7.2 23.5,3.81 R1.2 26.35,6.89 S_AH.1 26.35,7.1 D1.1
N$5
  Bottom 0.203: R9.2 23.5,17.78 R3.2 | R3.2 23.5,20.96 | R3.2 26.35,20.87 S_BH.1 26.35,21.08 D3.1
N$6
  Top 0.203: C22.1 15.3,27.85 15.3,25.4 U2.6
N$7
  Top 0.203: S_BL.1 40.96,21.08 D4.1 37.46,20.09 | R10.2 37.46,20.09 | 37.46,20.09 R4.2
N$8
  Bottom 0.203: U1.3 10.16,8.86 10.79,8.22 10.79,6.67 | 10.79,6.67 R21.1 | 10.79,6.67 R22.1
N$9
  Bottom 0.203: R11.2 23.5,31.75 R5.2 26.35,34.84 S_CH.1 26.35,35.04 D5.1
N$10
  Top 0.203: U3.6 C23.1
N$11
  Top 0.203: S_CL.1 40.96,35.04 D6.1 37.46,34.06 | R12.2 37.46,34.06 | 37.46,34.06 R6.2
N$12
  Bottom 0.203: U1.42 16.71,14.86 16.96,14.61 20,14.61 20,17.78 R9.1
N$13
  Bottom 0.203: U1.48 16.63,11.86 17.15,11.34 C1.1
N$14
  Bottom 0.203: U1.43 16.67,14.36 17.15,13.88 C2.1
N$15
  Bottom 0.203: U1.38 16.71,16.86 17.15,16.42 C3.1
N$16  (via drill 0.33)
  Top 0.203: R10.1 36.83,17.78 18.73,17.78 v18.73,16.51
  Bottom 0.203: v18.73,16.51 18.73,15.88 16.19,15.88 U1.40
N$17
  Bottom 0.203: U1.37 16.75,17.36 16.96,17.15 18.73,17.15 18.73,22.86 18.42,23.18 18.42,31.75 R11.1
N$18
  Top 0.203: S_AL.1 40.96,7.1 D2.1 37.46,6.12 | R8.2 37.46,6.12 | 37.46,6.12 R2.2
N$19  (via drill 0.33)
  Top 0.203: v17.15,31.12 18.42,31.12 18.42,31.75 36.83,31.75 R12.1
  Bottom 0.203: v17.15,31.12 17.15,22.54 17.46,22.23 17.46,19.69 17.97,19.18 17.97,18.42 16.23,18.42 U1.35
N$20  (via drill 0.33)
  Top 0.203: SJ1.2 7.62,12.38 v9.21,12.38
  Bottom 0.203: v9.21,12.38 9.21,12.36 U1.10
N$21  (via drill 0.33)
  Top 0.203: v9.21,15.36 9.21,16.83 SJ1.3
  Bottom 0.203: R15.2 C5.1 5.56,13.56 5.56,15.56 7.1,15.56 7.3,15.36 U1.16 v9.21,15.36 9.21,18.86 U1.23 6.03,18.86 SJ2.1
N$22
  Bottom 0.203: U1.27 9.62,20.86 10.25,21.49 C4.1
N$23
  Bottom 0.203: 8.19,13.86 U1.13 7.3,13.86 7.3,13.3 6.79,12.79 C6.1
N$24
  Bottom 0.203: 8.01,14.36 U1.14 6.35,14.36 C7.2
N$25
  Bottom 0.203: U1.15 6.35,14.86 C7.1
N$26
  Bottom 0.203: R16.2 R15.1 4.76,12.06 7.3,12.06 7.3,12.6 7.56,12.86 U1.11
N$29
  Bottom 0.203: 17.04,10.36 C8.2
  Bottom 0.254: 17.04,10.36 U1.51 U1.50
  Bottom 0.508: C8.2 18.42,10.25 18.42,6.59 D7.C
  Bottom 0.813: D7.C 16.02,5.33 L1.P$2
N$30
  Bottom 0.203: U1.52 16.6,9.86 16.93,9.53 17.46,9.53 C8.1
N$31
  Bottom 0.203: C11.2 R20.1 U1.2
N$32
  Bottom 0.203: R20.2 C10.2
N$33
  Bottom 0.203: U1.1 7.94,7.85 7.94,6.58 R19.2
N$34
  Bottom 0.203: U1.7 9.53,10.86 9.53,9.53 11.66,9.53 13.88,7.3 R23.1
N$36
  Bottom 0.254: IC1.2 IC1.1 6.9,38.91 R35.1
N$41
  Bottom 0.254: IC1.7 IC1.6 10.79,36.83 6.44,36.83 R38.1
N$42
  Bottom 0.254: IC1.8 IC1.9 10.79,35.56 7.71,35.56 R41.1
N$43
  Bottom 0.254: IC1.13 IC1.14 6.35,32.21 6.35,31.66 R32.1
N$44
  Bottom 0.254: R31.2 R30.1 IC1.3
N$46
  Bottom 0.254: R33.1 R34.2 IC1.10
N$47
  Bottom 0.254: R36.1 R37.2 IC1.5
N$48
  Bottom 0.254: IC1.12 R39.1 R40.2
PWM_A
  Bottom 0.203: JP1.3 1.91,11.43 3.17,12.7 3.17,14.61 4.55,15.98 7.2,15.98 7.32,15.86 U1.17
PWM_B
  Bottom 0.203: JP1.5 2.88,16.86 U1.19
PWM_C
  Bottom 0.203: JP1.7 3.17,19.69 3.17,17.86 U1.21
R_B  (via drill 0.33)
  Bottom 0.203: C2.2 17.15,15.36 | 17.15,15.36 U1.41 | 17.15,15.36 19.37,15.36 19.37,19.05 | R33.2 16.51,30.39 16.51,32.38 20,32.38 20.64,33.02 21.59,33.02 22.23,32.38 22.23,31.75
  other vias: 33.02,31.12 32.38,30.48 33.02,29.85 32.38,29.21 33.02,28.58 32.38,27.94 33.02,27.31 32.38,26.67 33.02,26.04 32.38,25.4 33.02,24.77 32.38,24.13 33.02,23.5 32.38,22.86 33.02,22.23 32.38,21.59 33.02,20.96 32.38,20.32 33.02,19.69 32.38,19.05 31.75,31.12 31.12,30.48 31.75,29.85 31.12,29.21 31.75,28.58 31.12,27.94 31.75,27.31 31.12,26.67 31.75,26.04 31.12,25.4 31.75,24.77 31.12,24.13 31.75,23.5 31.12,22.86 31.75,22.23 31.12,21.59 31.75,20.96 31.12,20.32 31.75,19.69 31.12,19.05 30.48,19.69 29.85,19.05 28.58,20.32 29.21,19.69 28.58,19.05 30.48,31.12 29.85,30.48 30.48,29.85 29.85,29.21 30.48,28.58 29.85,27.94 30.48,27.31 29.85,26.67 30.48,26.04 29.85,25.4 30.48,24.77 29.21,31.12 28.58,30.48 29.21,29.85 28.58,29.21 29.21,28.58 28.58,27.94 29.21,27.31 28.58,26.67 29.21,26.04 28.58,25.4 29.21,24.77 28.58,24.13 30.48,22.23 29.21,22.23 28.58,22.86 27.94,31.12 27.31,30.48 26.67,31.12 26.04,30.48 25.4,31.12 25.4,29.85 26.67,29.85 27.94,29.85 27.94,24.77 26.67,24.77 25.4,24.77 27.94,19.69 27.31,19.05 26.67,19.69 26.04,19.05 25.4,19.69 24.77,19.05 24.13,19.69 22.86,19.69 22.23,19.05 22.23,20.32 21.59,19.69 20.96,20.32 20.96,19.05 20.32,19.69 19.69,19.05 19.69,20.32 19.69,21.59 23.5,24.13 24.13,23.5 22.86,23.5 22.23,24.13 21.59,23.5 20.96,24.13 20.32,20.96
  pour Bottom (rank 2, no thermals): 33.66,31.75 18.42,31.75 18.42,18.42 33.66,18.42
  pour Top (rank 2, no thermals): 24.77,31.75 33.66,31.75 33.66,18.42 15.88,18.42 15.88,24.77 24.77,24.77
R_C  (via drill 0.33)
  Top 0.203: v17.78,31.75 17.78,33.02
  Bottom 0.203: U1.36 17.13,17.86 C3.2 18.35,17.87 18.35,19.43 18.1,19.69 18.1,22.54 17.78,22.86 v17.78,31.75 | R36.2 17.15,42
  other vias: 33.02,43.81 32.38,43.18 33.02,42.54 32.38,41.91 33.02,41.27 32.38,40.64 33.02,40 32.38,39.37 33.02,38.73 32.38,38.1 33.02,37.46 32.38,36.83 33.02,36.2 32.38,35.56 33.02,34.92 32.38,34.29 33.02,33.66 32.38,33.02 31.12,33.02 31.75,43.81 31.12,43.18 31.75,42.54 31.12,41.91 31.75,41.27 31.12,40.64 31.75,40 31.12,39.37 31.75,38.73 31.12,38.1 31.75,37.46 31.12,36.83 31.75,36.2 31.12,35.56 31.75,34.92 31.12,34.29 31.75,33.66 30.48,43.81 29.85,43.18 30.48,42.54 29.85,41.91 30.48,41.27 29.85,40.64 30.48,40 29.85,39.37 30.48,38.73 30.48,36.2 30.48,33.66 29.85,33.02 28.58,33.02 29.21,43.81 28.58,43.18 29.21,42.54 28.58,41.91 29.21,41.27 28.58,40.64 29.21,40 28.58,39.37 29.21,38.73 28.58,38.1 28.58,36.83 29.21,36.2 28.58,34.29 29.21,33.66 27.94,43.81 26.67,43.81 25.4,43.81 27.94,38.73 26.67,38.73 25.4,38.73 27.94,33.66 27.31,33.02 26.67,33.66 26.04,33.02 25.4,33.66 24.77,33.02 24.13,33.66 22.86,33.66 22.23,34.29 21.59,33.66 20.96,34.29 20.32,33.66 19.69,34.29 19.05,33.66 18.42,34.29 17.78,33.66 17.78,34.92 19.05,34.92 19.69,35.56 18.42,35.56 24.13,38.1 23.5,37.46 22.86,38.1 22.23,37.46 21.59,38.1 20.96,37.46 19.69,33.02 17.15,35.56 17.15,34.29 20.32,34.92 18.42,33.02
  pour Bottom (rank 2, no thermals): 33.66,44.45 16.51,44.45 16.51,32.38 33.66,32.38
  pour Top (rank 2, no thermals): 24.77,44.45 33.66,44.45 33.66,32.07 15.88,32.07 15.88,38.73 24.77,38.73
V+  (via drill 0.33)
  Top 0.254: v14.61,8.26 14.61,3.17 v19.69,3.17
  Bottom 0.203: R30.2 8.89,43.81 9.53,44.45 38.1,44.45 S_CH.4
  Bottom 0.254: U1.29 14.48,21.36 14.48,9.36 U1.53 U1.54 14.61,8.86 v14.61,8.26
  other vias: 43.81,24.13 43.81,25.4 45.09,25.4 45.09,39.37 44.45,38.73 43.81,38.1 43.81,10.16 45.09,38.1 45.09,24.13 41.91,32.38 41.91,31.12 41.27,17.78 41.91,18.42 41.91,17.15 44.45,10.79 43.81,11.43 45.09,10.16 45.09,11.43 44.45,24.77 43.81,39.37 41.27,31.75 42.54,1.91 40,1.91 37.46,1.91 34.92,1.91 32.38,1.91
  pour Bottom (rank 5, no thermals): 33.66,44.45 46.35,44.45 46.35,41.91 46.04,41.59 46.04,0 19.05,0 19.05,4.45 33.66,4.45
  pour Top (rank 4, no thermals): 45.4,26.04 45.4,23.5 43.5,23.5 43.5,26.04
  pour Top (rank 4, no thermals): 43.5,37.46 43.5,40 45.4,40 45.4,37.46
  pour Top (rank 4, no thermals): 40.96,16.83 42.23,16.83 42.23,18.73 40.96,18.73
  pour Top (rank 4, no thermals): 43.5,9.53 43.5,12.06 45.4,12.06 45.4,9.53
  pour Top (rank 4, no thermals): 42.23,30.8 40.96,30.8 40.96,32.7 42.23,32.7
V-  (via drill 0.33)
  Top 0.203: v16.51,29.21 v16.51,33.02
  Bottom 0.203: U1.31 16.83,20.36 16.83,21.91 16.51,22.23 v16.51,29.21 10.16,29.21 | 10.16,29.21 R34.1 | 10.16,29.21 7.62,29.21 R40.1 | 10.16,41.27 7.62,41.27 R31.1 7.62,45.09 | 10.16,41.27 R37.1 | v16.51,33.02 16.51,41.27 10.16,41.27
  other vias: 33.02,48.26 32.38,47.62 33.02,46.99 32.38,46.35 33.02,45.72 32.38,45.09 29.21,45.72 28.58,45.09 29.21,46.99 28.58,46.35 28.58,47.62 29.21,48.26 22.23,45.09 21.59,45.72 22.23,46.35 21.59,46.99 22.23,47.62 21.59,48.26 23.5,45.09 22.86,45.72 23.5,46.35 22.86,46.99 23.5,47.62 22.86,48.26 24.77,45.09 24.13,45.72 24.77,46.35 24.13,46.99 24.77,47.62 24.13,48.26 26.04,45.09 25.4,45.72 26.04,46.35 25.4,46.99 26.04,47.62 25.4,48.26 27.31,45.09 26.67,45.72 27.31,46.35 26.67,46.99 27.31,47.62 26.67,48.26 27.94,45.72 27.94,46.99 27.94,48.26 17.15,47.62 14.61,47.62 12.06,47.62 9.53,47.62 6.98,47.62
  pour Top (rank 3, no thermals): 4.45,49.53 33.5,49.53 33.5,44.6 4.45,44.6
  pour Bottom (rank 3, no thermals): 4.45,49.53 33.5,49.53 33.5,44.6 4.45,44.6
V_A
  Bottom 0.254: C18.2 3.72,31.12 | 3.72,31.12 JP1.11 | R32.2 3.72,31.12
V_B
  Bottom 0.254: C21.2 3.72,33.66 | 3.72,33.66 JP1.12 | 3.72,33.66 R41.2
V_C
  Bottom 0.254: C20.2 3.72,36.2 | 3.72,36.2 JP1.13 | 3.72,36.2 R38.2
V_LOW  (via drill 0.33)
  Top 0.203: v17.15,19.05 17.15,18.42 34.29,18.42
  Bottom 0.203: U1.30 14.86,20.86 14.86,18.86 | 14.86,18.86 U1.34 17.15,18.86 v17.15,19.05 | 14.86,18.86 14.86,16.36 | 14.86,16.36 U1.39 | 14.86,16.36 14.86,13.86 U1.44
  other vias: 34.29,48.26 34.92,47.62 34.29,46.99 34.92,46.35 34.29,45.72 34.92,45.09 38.73,45.09 38.1,45.72 38.73,46.35 38.1,46.99 38.73,47.62 38.1,48.26 40,45.09 39.37,45.72 40,46.35 39.37,46.99 40,47.62 39.37,48.26 41.27,45.09 40.64,45.72 41.27,46.35 40.64,46.99 41.27,47.62 40.64,48.26 42.54,45.09 41.91,45.72 42.54,46.35 41.91,46.99 42.54,47.62 41.91,48.26 43.18,45.72 43.81,46.35 43.18,46.99 43.81,47.62 43.18,48.26 44.45,45.72 45.09,46.35 44.45,46.99 45.09,47.62 44.45,48.26 45.72,45.72 45.72,46.99 45.72,48.26 43.81,45.09 45.09,45.09 43.81,7.3 45.09,7.3 45.09,42.23 45.09,35.24 44.45,42.86 45.09,28.26 43.81,28.26 43.81,42.23 43.81,21.27 44.45,34.61 44.45,18.42 44.45,17.15 45.09,17.78 44.45,14.92 43.81,14.29 45.09,14.29 44.45,20.64 45.09,21.27 43.81,35.24 44.45,6.67 44.45,28.89 44.45,31.12 45.09,31.75 44.45,32.38
  pour Top (rank 5, no thermals): 33.5,49.53 33.66,3.81 44.13,3.81 47.31,6.98 47.31,41.91 46.35,42.86 46.35,47.62 47.62,47.62 47.62,49.53
  pour Bottom (rank 4, no thermals): 33.5,49.53 47.62,49.53 47.62,47.62 46.35,47.62 46.35,44.45 33.5,44.45
  pour Bottom (rank 4, no thermals): 45.4,15.24 43.5,15.24 43.5,13.97 45.4,13.97
  pour Bottom (rank 4, no thermals): 43.5,6.35 45.4,6.35 45.4,7.62 43.5,7.62
  pour Bottom (rank 4, no thermals): 45.4,29.21 43.5,29.21 43.5,27.94 45.4,27.94
  pour Bottom (rank 4, no thermals): 43.5,34.29 45.4,34.29 45.4,35.56 43.5,35.56
  pour Bottom (rank 4, no thermals): 43.5,41.91 46.35,41.91 46.35,44.45 43.5,44.45
  pour Bottom (rank 4, no thermals): 44.13,32.7 44.13,30.8 45.4,30.8 45.4,32.7
  pour Bottom (rank 4, no thermals): 45.4,21.59 43.5,21.59 43.5,20.32 45.4,20.32
  pour Top (rank 4, no thermals): 44.13,18.73 45.4,18.73 45.4,16.83 44.13,16.83
  pour Bottom (rank 4, no thermals): 45.4,16.83 45.4,18.73 44.13,18.73 44.13,16.83
V_P
  Bottom 0.254: C19.2 3.72,41.27 | 3.72,41.27 JP1.15 | 3.72,41.27 R35.2
VCC  (via drill 0.33)
  Top 0.203: U4.3 6.35,22.85 6.35,24.15 U4.1 4.52,24.15 C12.1
  Top 0.254: 6.35,22.85 v6.35,3.17
  Bottom 0.203: R21.2 8.8,5.17 10.27,3.71 L1.P$1
  Bottom 0.254: C9.1 v6.35,3.17
  Bottom 0.813: L1.P$1 C9.1

### Text on the board
tPlace: VP | IP | VC | VB | VA | IC | IB
bPlace: - | GND | C | IC | IB | B | !C | C | !B | B | !A | A | A | 5 | +
tStop: 04/2012
bStop: Tiny | v2.2 | Husk